# EAGLE design breakout (EAGLE 6.4)
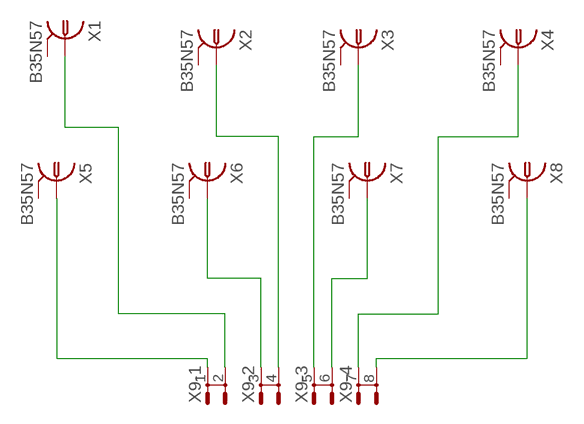
[diagram p0: schematic, sheet 1]

## Parts
X1  B35N57  [B35N57]
X2  B35N57  [B35N57]
X3  B35N57  [B35N57]
X4  B35N57  [B35N57]
X5  B35N57  [B35N57]
X6  B35N57  [B35N57]
X7  B35N57  [B35N57]
X8  B35N57  [B35N57]
X9  SH5-4  [SH5-4]

## Nets
N$1: X5.1 X9.1
N$2: X1.1 X9.2
N$3: X6.1 X9.3
N$4: X2.1 X9.4
N$5: X3.1 X9.5
N$6: X7.1 X9.6
N$7: X4.1 X9.7
N$8: X8.1 X9.8
Unconnected: X1.2 X1.3 X1.4 X1.5 X2.2 X2.3 X2.4 X2.5 X3.2 X3.3 X3.4 X3.5 X4.2 X4.3 X4.4 X4.5 X5.2 X5.3 X5.4 X5.5 X6.2 X6.3 X6.4 X6.5 X7.2 X7.3 X7.4 X7.5 X8.2 X8.3 X8.4 X8.5

## Library data of the parts
X1-X8 = con-coax:B35N57: BNC CONNECTOR M/A COM www.macom.com; OC_FARNELL: unknown; OC_NEWARK: unknown
X9 = con-rib:SH5-4: RIBBON CABLE CONNECTOR Flachstecker / Faston; OC_FARNELL: unknown; OC_NEWARK: unknown

## Board
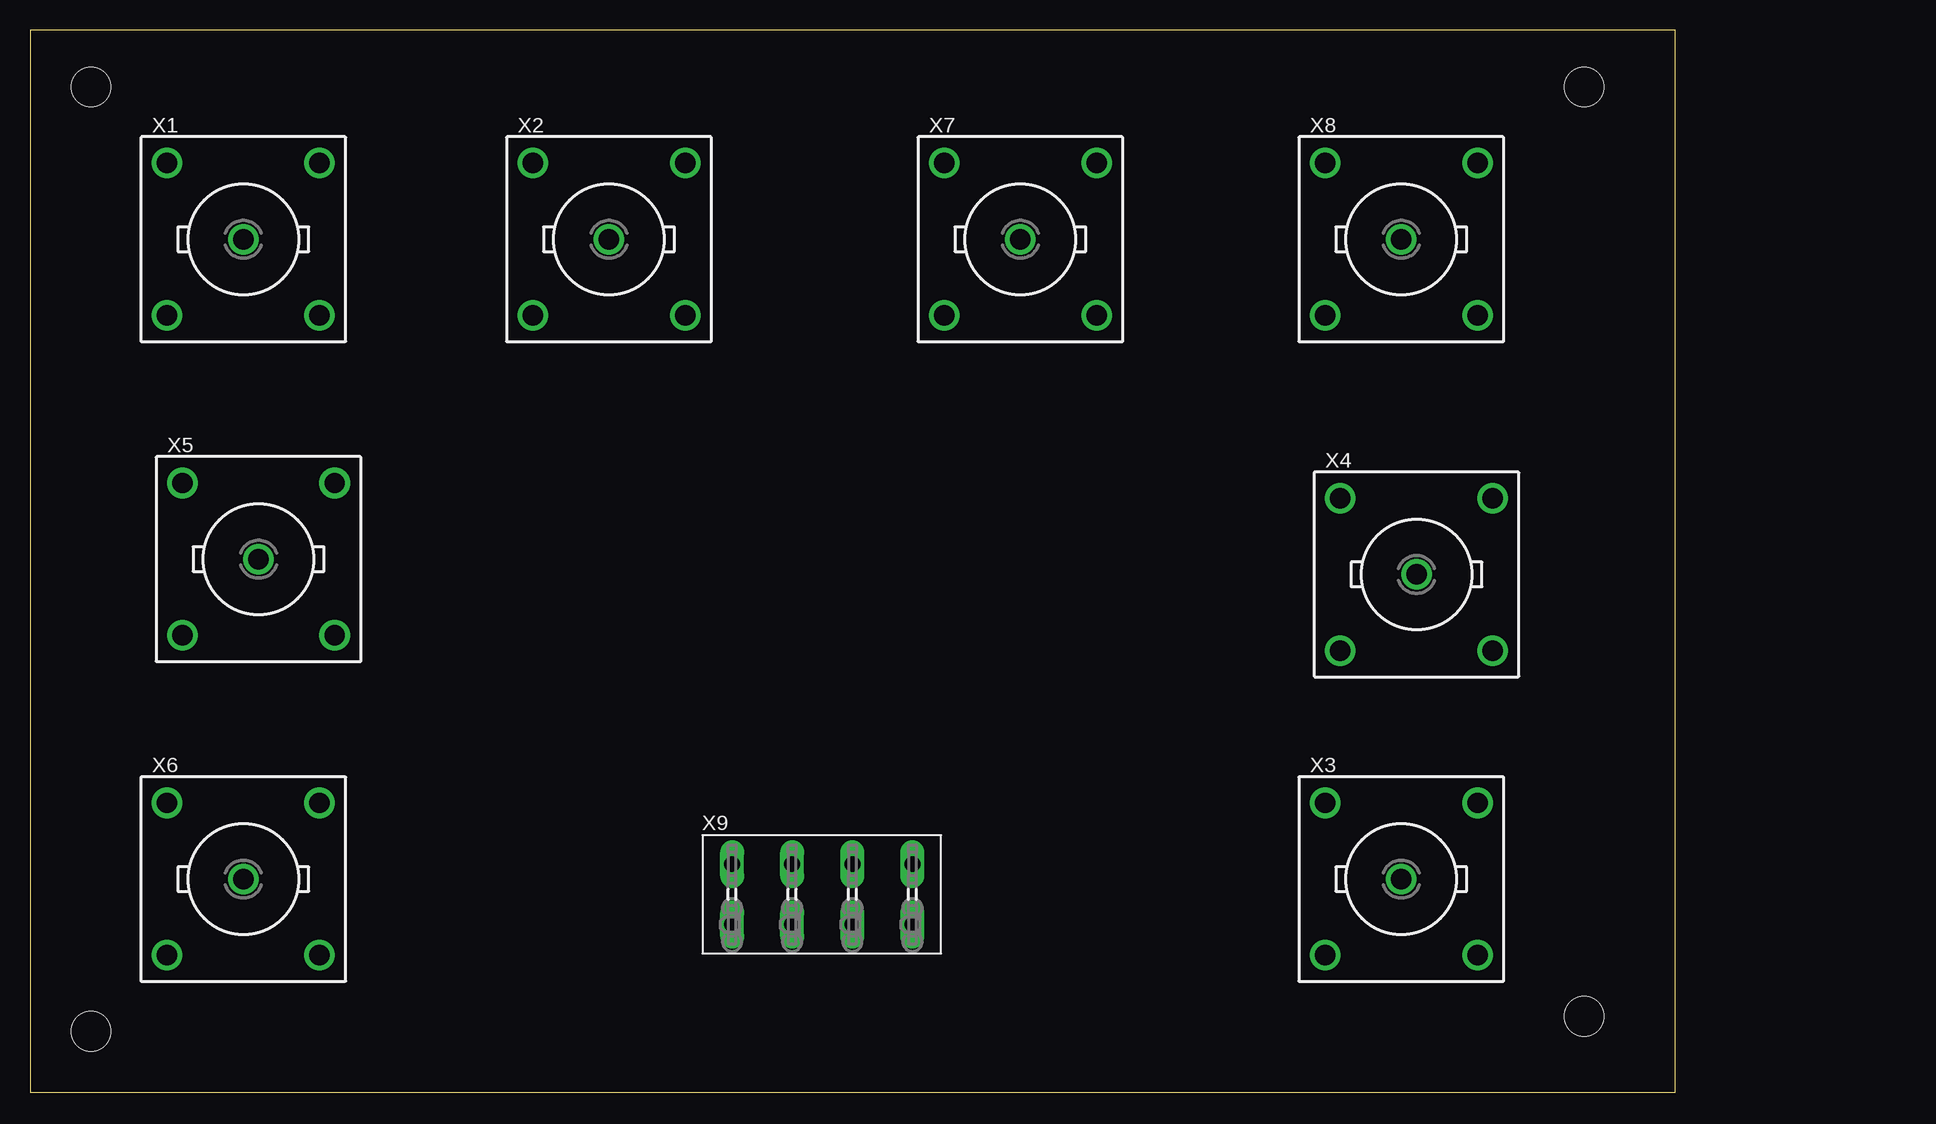
[diagram p1: board, top side]
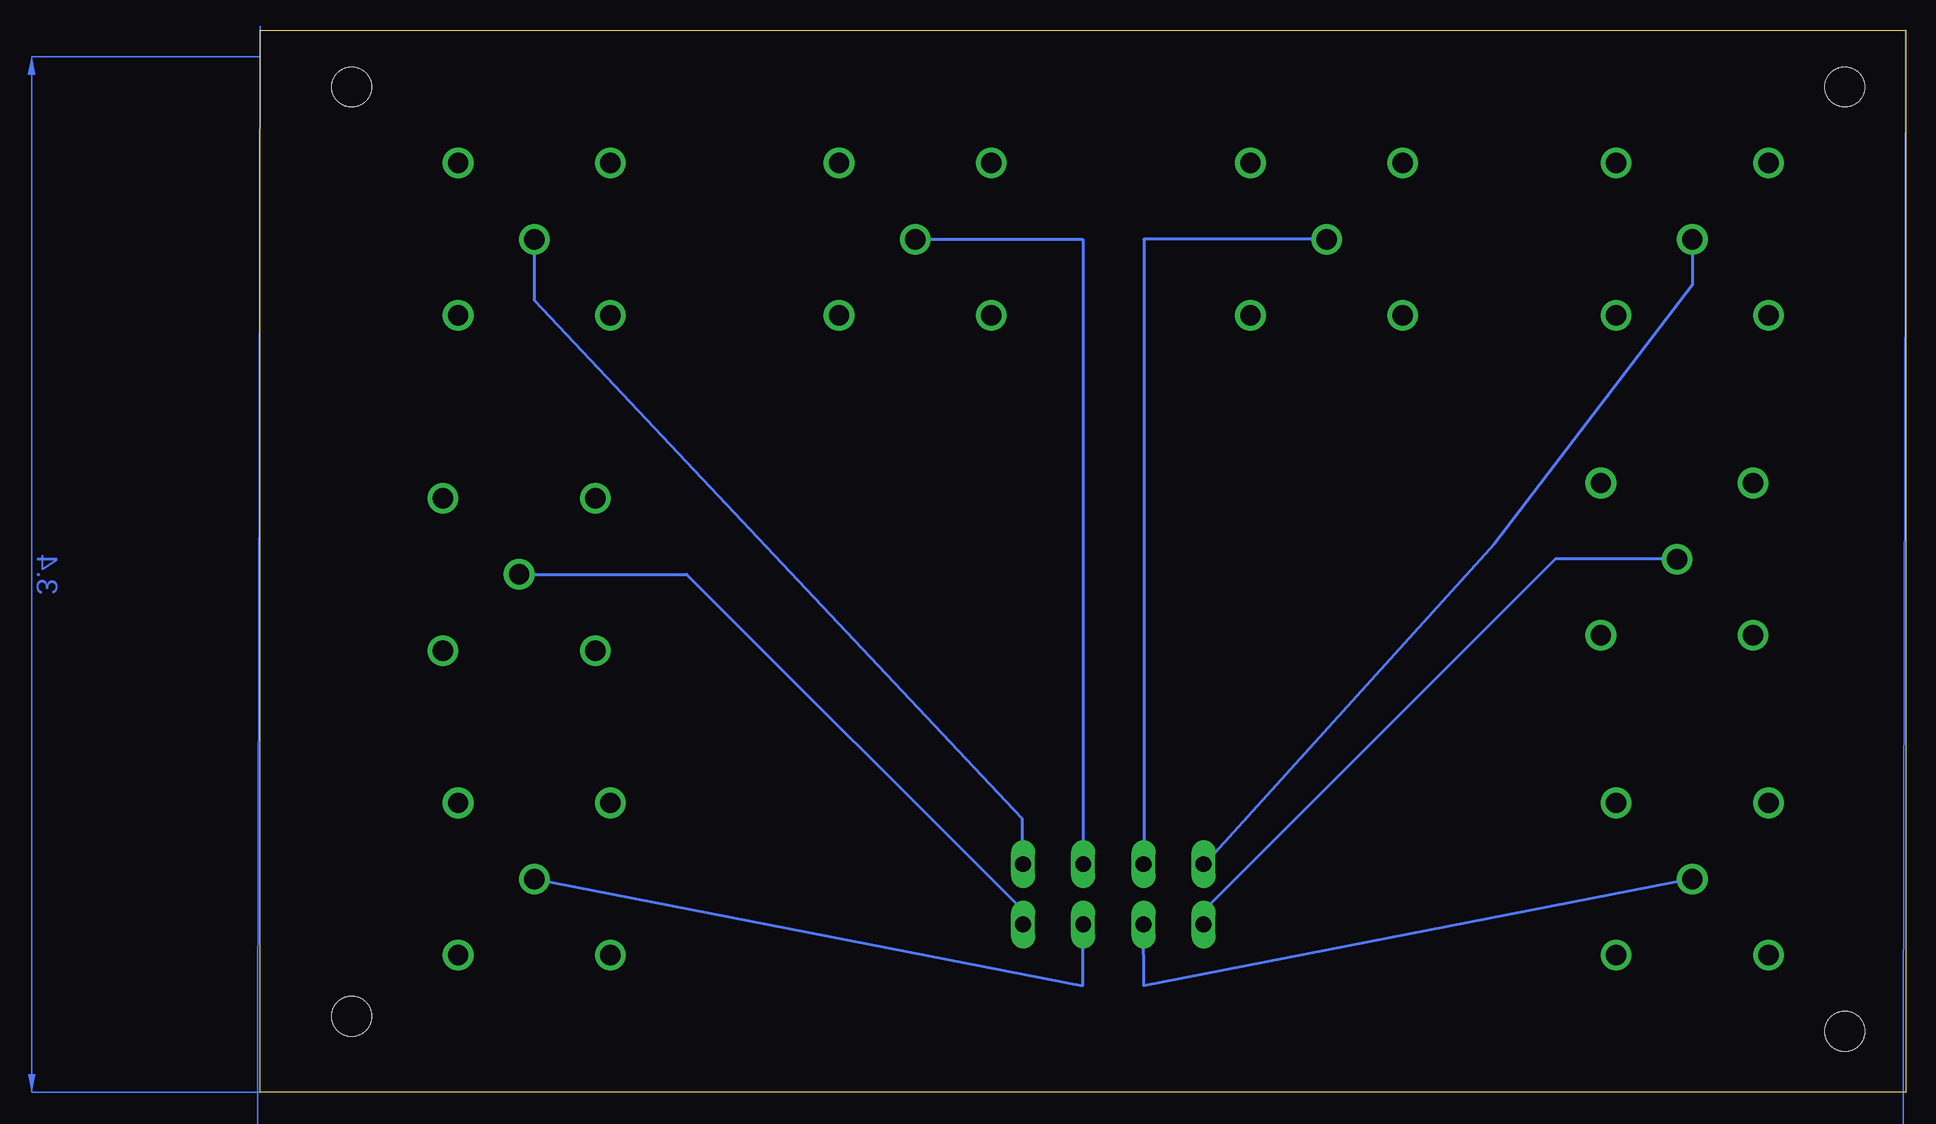
[diagram p2: board, bottom side, seen from below]

Size 137.14 x 88.57 mm. Coordinates in mm from the lower left corner, seen from the top.
Outline: 0,0 137.14,0 137.14,88.57 0,88.57 0,0
Copper layers (1*16): Top 0.035mm / dielectric 1.5mm / Bottom 0.035mm
Design rules "default": minimum track width 10mil, minimum drill 24mil, track to track 8mil, track to pad 8mil, pad to pad 8mil, via to via 8mil, smd to smd 8mil, copper to edge 40mil, drill to drill 8mil, minimum pad ring 10mil, minimum via ring 8mil, stop-mask expansion 4mil, vias tented up to drill 0mil, thermal gap 10mil
Holes 3.3 mm at 129.54,83.82 129.54,6.35 5.08,5.08 5.08,83.82

### Footprints (pad centres in the part's own frame; a part is rotated, then mirrored left to right if it is on the bottom)
B35N57 = drill 1.7: 1 0,0; 2 6.35,6.35; 3 -6.35,6.35; 4 -6.35,-6.35; 5 6.35,-6.35
SH5-4 = drill 1.321 long: 1 -7.518,-2.515; 2 -7.518,2.515; 3 -2.515,-2.515; 4 -2.515,2.515; 5 2.515,-2.515; 6 2.515,2.515; 7 7.518,-2.515; 8 7.518,2.515

### Placement (x,y rotation side)
X1  17.78,71.12 0 top
X2  48.26,71.12 0 top
X3  114.3,17.78 0 top
X4  115.57,43.18 0 top
X5  19.05,44.45 0 top
X6  17.78,17.78 0 top
X7  82.55,71.12 0 top
X8  114.3,71.12 0 top
X9  66.04,16.51 0 top

### Tracks (layer width: path | path; a pad name or v marks a point on that pad's centre or on a via)
N$1
  Bottom 0.254: X5.1 29.21,44.45 58.42,15.24 X9.1
N$2
  Bottom 0.254: X1.1 17.78,67.31 34.29,45.72 58.42,19.05 X9.2
N$3
  Bottom 0.254: X9.3 63.5,8.89 X6.1
N$4
  Bottom 0.254: X2.1 63.5,71.12 63.5,19.05 X9.4
N$5
  Bottom 0.254: X9.5 68.58,8.89 X3.1
N$6
  Bottom 0.254: X7.1 68.58,71.12 68.58,19.05 X9.6
N$7
  Bottom 0.254: X4.1 101.6,43.18 73.66,15.24 X9.7
N$8
  Bottom 0.254: X8.1 114.3,66.04 73.66,22.86 73.66,19.05 X9.8
(copper drawn outside any net)
  shapes: Bottom area x2